# Altium schematic sheet robot-basketball-basket-counter.SchDoc
size A4; SheetNumber: 1; SheetTotal: 1
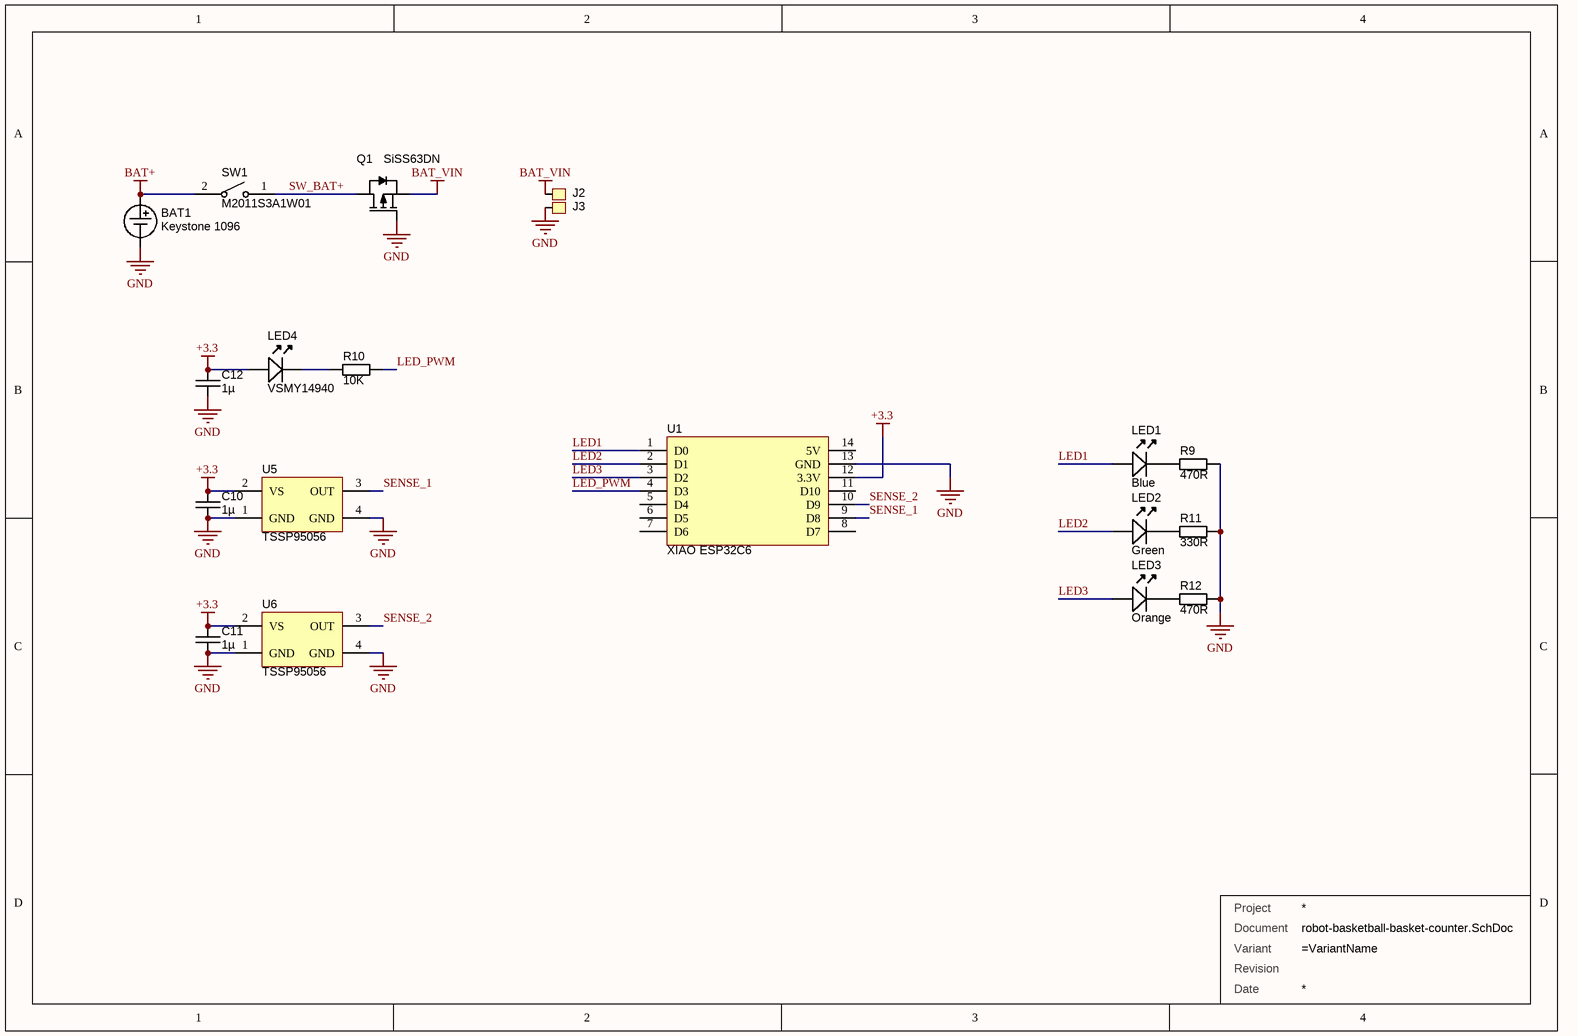
[diagram p0: robot-basketball-basket-counter.SchDoc]

## Parts
BAT1  Keystone 1096  [Keystone_PN1096]
C10  value 1µ  [CAPC1608X90N]  (hidden comment: approved sub OK)
C11  value 1µ  [CAPC1608X90N]  (hidden comment: approved sub OK)
C12  value 1µ  [CAPC1608X90N]  (hidden comment: approved sub OK)
J2  PAD  [PAD_3.0x2.0]  (value not drawn)  (no BOM)
J3  PAD  [PAD_3.0x2.0]  (value not drawn)  (no BOM)
LED1  Blue  [LED-0603-GREEN]
LED2  Green  [LED-0603-GREEN]
LED3  Orange  [LED-0603-YELLOW]
LED4  VSMY14940  [VSMY14940]
Q1  SiSS63DN  [Vishay_PowerPAK_1212-8S]
R9  value 470R  [RESC1608X55N]  (hidden comment: Thick Film)
R10  value 10K  [RESC1608X55N]  (hidden comment: Thick Film)
R11  value 330R  [RESC1608X55N]  (hidden comment: Thick Film)
R12  value 470R  [RESC1608X55N]  (hidden comment: Thick Film)
SW1  M2011S3A1W01  [M2011S3A1W01]
TitleBlock  TitleBlock  (value not drawn)  (graphical)
U1  XIAO ESP32C6  [XIAO_ESP32_C6]
U5  TSSP95056  [VISHAY_HEIMDALL_VERTICAL]
U6  TSSP95056  [VISHAY_HEIMDALL_VERTICAL]

## Nets
+3.3: C10.1 C11.1 C12.1 LED4.A U1.12(3.3V) U5.2(VS) U6.2(VS)
BAT+: BAT1.plus SW1.2
BAT_VIN: J2.1 Q1.S
GND: BAT1.minus C10.2 C11.2 C12.2 J3.1 Q1.G R9.1 R11.1 R12.1 U1.13(GND) U5.1(GND) U5.4(GND) U6.1(GND) U6.4(GND)
LED1: LED1.A U1.1(D0)
LED2: LED2.A U1.2(D1)
LED3: LED3.A U1.3(D2)
LED_PWM: R10.1 U1.4(D3)
SENSE_1: U1.9(D8) U5.3(OUT)
SENSE_2: U1.10(D9) U6.3(OUT)
SW_BAT+: Q1.D SW1.1
NetLED1_K: LED1.K R9.2
NetLED2_K: LED2.K R11.2
NetLED3_K: LED3.K R12.2
NetLED4_K: LED4.K R10.2

Not connected (* = marked no-connect by the designer): U1 5(D4) 6(D5) 7(D6) 8(D7) 11(D10) 14(5V)

## Notes on the sheet
- (in symbol TitleBlock) Project; Document; Variant; Revision; Date

## Library data of the parts
BAT1 = Keystone_1096
C10-C12 = CAPC_1u_0603_X7R_16V_10%: Capacitor SMD Cer 1uF 10% 16V X7R 0603; Manufacturer 1: TDK Corporation; Manufacturer Part Number 1: C1608X7R1C105K; Ratings: 16V; X7R; Material: ceramic; SCDType: spec; Package / Case: 0603 (1608 metric); Tolerance: ±10%; Supplier 1: Digi-Key; Supplier Part Number 1: 445-1604-1-ND; ComponentLink1URL: http://product.tdk.com/capacitor/mlcc/en/documents/mlcc_commercial_general_en.pdf; ComponentLink1Description: http://product.tdk.com/capacitor/mlcc/en/documents/mlcc_commercial_general_en.pdf
LED1 = LED_SMD_Green_0603_570nm: LED 0603 SMD Green 570nm 50mcd 20mA; Manufacturer 1: Kingbright Company LLC; Manufacturer Part Number 1: APT1608CGCK; Material: AlGaInP; Ratings: 20mcd min; 50 mcd typ; 570 nm; Voltage - Forward (Vf) Typ: 2.1V; Viewing Angle: 120°; Lens Style/Size: Rectangle with Flat Top, 1.1mm x 0.8mm; Voltage - Forward (Vf) @ 10mA: 2.0V; SCDType: source; Wavelength - Peak: 574nm; Lens Type: Clear; Package / Case: 0603 (1608 metric); Color: Green; Current - Test: 20mA; Supplier 1: Digi-Key; Supplier Part Number 1: 754-1116-1-ND; RoHS 1: RoHS Compliant; Wavelength - Dominant: 570nm; ComponentLink1URL: http://www.us.kingbright.com/images/catalog/SPEC/APT1608CGCK.pdf; ComponentLink1Description: http://www.us.kingbright.com/images/catalog/SPEC/APT1608CGCK.pdf
LED2 = LED_SMD_Green_0603_570nm: LED 0603 SMD Green 570nm 50mcd 20mA; Manufacturer 1: Kingbright Company LLC; Manufacturer Part Number 1: APT1608CGCK; Material: AlGaInP; Ratings: 20mcd min; 50 mcd typ; 570 nm; Voltage - Forward (Vf) Typ: 2.1V; Voltage - Forward (Vf) @ 10mA: 2.0V; SCDType: source; Viewing Angle: 120°; Lens Style/Size: Rectangle with Flat Top, 1.1mm x 0.8mm; Wavelength - Peak: 574nm; Lens Type: Clear; Package / Case: 0603 (1608 metric); Supplier 1: Digi-Key; Supplier Part Number 1: 754-1116-1-ND; ComponentLink1URL: http://www.us.kingbright.com/images/catalog/SPEC/APT1608CGCK.pdf; ComponentLink1Description: http://www.us.kingbright.com/images/catalog/SPEC/APT1608CGCK.pdf; Color: Green; Current - Test: 20mA; RoHS 1: RoHS Compliant; Wavelength - Dominant: 570nm
LED3 = LED_SMD_Yellow_0603_150mcd: LED 0603 SMD Yellow 590nm 150mcd 20mA; Manufacturer 1: Kingbright Company LLC; Manufacturer Part Number 1: APT1608SYCK; Material: AlGaInP on GaAs; Ratings: 150 mcd; 590 nm; Voltage - Forward (Vf) Typ: 2V; Voltage - Forward (Vf) @ 10mA: 1.95V; SCDType: source; Package / Case: 0603 (1608 metric); Supplier 1: Digi-Key; Supplier Part Number 1: 754-1124-1-ND; ComponentLink1URL: http://www.us.kingbright.com/images/catalog/SPEC/APT1608SYCK.pdf; ComponentLink1Description: http://www.us.kingbright.com/images/catalog/SPEC/APT1608SYCK.pdf
R9 R12 = RES_470R_0603_5%: Resistor SMD chip 470 Ohm 0.1W 5% 0603; Manufacturer 1: Vishay/Dale; Manufacturer Part Number 1: CRCW0603470RJNEA; Ratings: 1/10 W; SCDType: spec; Package / Case: 0603 (1608 metric); Supplier 1: Digi-Key; Supplier Part Number 1: 541-470GCT-ND; Tolerance: ±5%; Material: Thick Film
R10 = RES_10K_0603_1%: Resistor SMD chip 10k Ohm 0.1W 1% 0603; Manufacturer 1: Yageo; Manufacturer Part Number 1: RC0603FR-0710KL; Ratings: 1/10W; SCDType: spec; Package / Case: 0603 (1608 Metric); Supplier 1: Digi-Key; Supplier Part Number 1: 311-10.0KHRCT-ND; Tolerance: ±1%
R11 = RES_330R_0603_5%: Resistor SMD chip 330 Ohm 0.1W 5% 0603; Manufacturer 1: Vishay Dale; Manufacturer Part Number 1: CRCW0603330RJNEA; Ratings: 1/10 W; SCDType: spec; Package / Case: 0603 (1608 metric); Supplier 1: Digi-Key; Supplier Part Number 1: 541-330GCT-ND; Tolerance: ±5%; Manufacturer 2: Yageo; Manufacturer Part Number 2: RC0603JR-07330RL; Material: Thick Film; ComponentLink1URL: http://www.vishay.com/doc?20035; ComponentLink1Description: http://www.vishay.com/doc?20035; Supplier 2: Digi-Key; Supplier Part Number 2: 311-330GRCT-ND; ComponentLink2URL: http://www.yageo.com/documents/recent/PYu-RC0603_51_RoHS_L_4.pdf; ComponentLink2Description: http://www.yageo.com/documents/recent/PYu-RC0603_51_RoHS_L_4.pdf
U1 = XIAO_ESP32_C6